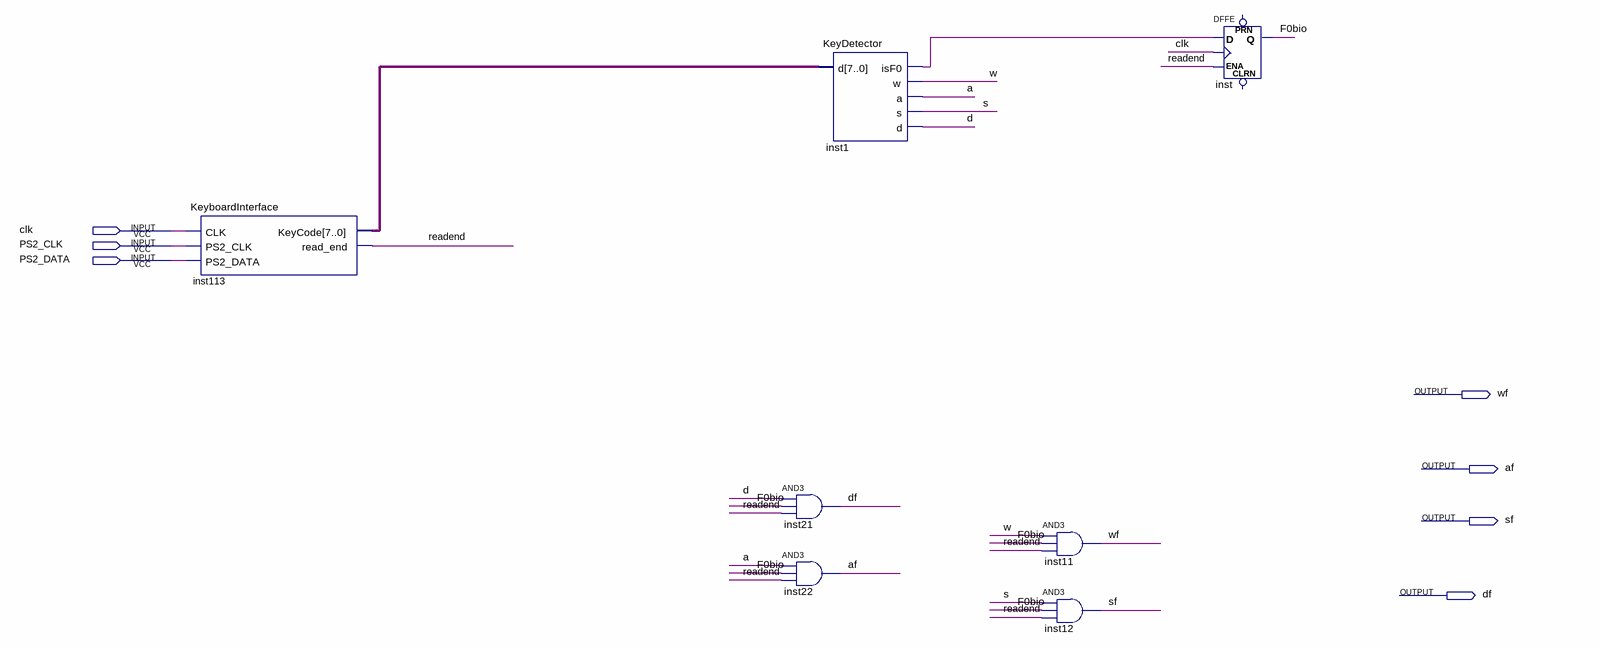
[diagram p0: schematic sheet]
// Quartus schematic tastatura.bdf as structural Verilog: 7 symbols, 7 pins
module tastatura (
  input  clk,
  input  PS2_CLK,
  input  PS2_DATA,
  output wf,
  output af,
  output sf,
  output df
);

  wire a, d, F0bio, inst1_isf0, readend, s, w;
  wire [7:0] inst113_keycode;

  KeyboardInterface inst113 (
    .CLK(clk), .PS2_CLK(PS2_CLK), .PS2_DATA(PS2_DATA), .KeyCode(inst113_keycode), .read_end(readend));
  KeyDetector inst1 (.d({inst113_keycode, d}), .isF0(inst1_isf0), .w(w), .a(a), .s(s));
  and inst21 (df, d, F0bio, readend);
  and inst22 (af, a, F0bio, readend);
  and inst11 (wf, w, F0bio, readend);
  and inst12 (sf, s, F0bio, readend);
  DFFE inst (.D(inst1_isf0), .CLK(clk), .ENA(readend), .Q(F0bio));  // open: PRN, CLRN
endmodule
